# EAGLE design lixie_digit_mini (EAGLE 7.6.0)
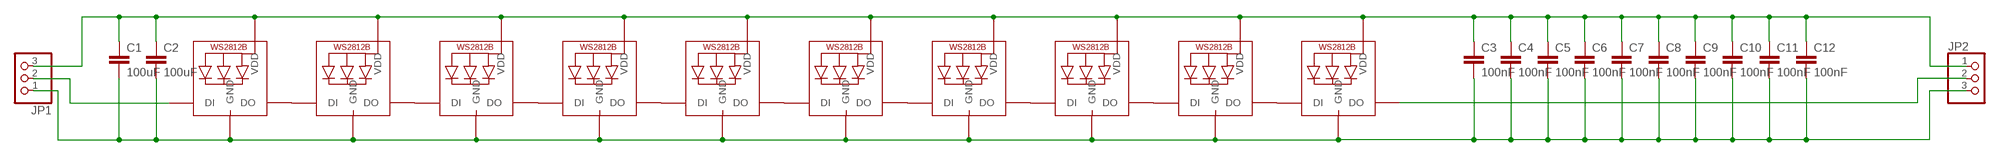
[diagram p0: schematic, sheet 1]

## Parts
C1  100uF  C-EUC1206K  [C1206K]
C2  100uF  C-EUC1206K  [C1206K]
C3  100nF  C-EUC0805K  [C0805K]
C4  100nF  C-EUC0805K  [C0805K]
C5  100nF  C-EUC0805K  [C0805K]
C6  100nF  C-EUC0805K  [C0805K]
C7  100nF  C-EUC0805K  [C0805K]
C8  100nF  C-EUC0805K  [C0805K]
C9  100nF  C-EUC0805K  [C0805K]
C10  100nF  C-EUC0805K  [C0805K]
C11  100nF  C-EUC0805K  [C0805K]
C12  100nF  C-EUC0805K  [C0805K]
JP1  PINHD-1X3  [1X03]
JP2  PINHD-1X3  [1X03]
LED1  WS2812B5050  [WS2812B]
LED2  WS2812B5050  [WS2812B]
LED3  WS2812B5050  [WS2812B]
LED4  WS2812B5050  [WS2812B]
LED5  WS2812B5050  [WS2812B]
LED6  WS2812B5050  [WS2812B]
LED7  WS2812B5050  [WS2812B]
LED8  WS2812B5050  [WS2812B]
LED9  WS2812B5050  [WS2812B]
LED10  WS2812B5050  [WS2812B]

## Nets
GND: C1.2 C2.2 C3.2 C4.2 C5.2 C6.2 C7.2 C8.2 C9.2 C10.2 C11.2 C12.2 JP1.1 JP2.3 LED1.3-GND(GND) LED2.3-GND(GND) LED3.3-GND(GND) LED4.3-GND(GND) LED5.3-GND(GND) LED6.3-GND(GND) LED7.3-GND(GND) LED8.3-GND(GND) LED9.3-GND(GND) LED10.3-GND(GND)
N$1: LED1.2-DOUT(DO) LED2.4-DIN(DI)
N$2: LED2.2-DOUT(DO) LED3.4-DIN(DI)
N$3: LED3.2-DOUT(DO) LED4.4-DIN(DI)
N$4: LED4.2-DOUT(DO) LED5.4-DIN(DI)
N$5: LED5.2-DOUT(DO) LED6.4-DIN(DI)
N$16: LED6.2-DOUT(DO) LED7.4-DIN(DI)
N$17: LED7.2-DOUT(DO) LED8.4-DIN(DI)
N$18: LED8.2-DOUT(DO) LED9.4-DIN(DI)
N$19: LED9.2-DOUT(DO) LED10.4-DIN(DI)
N$23: JP1.2 LED1.4-DIN(DI)
N$24: JP2.2 LED10.2-DOUT(DO)
VCC: C1.1 C2.1 C3.1 C4.1 C5.1 C6.1 C7.1 C8.1 C9.1 C10.1 C11.1 C12.1 JP1.3 JP2.1 LED1.1-VDD(VDD) LED2.1-VDD(VDD) LED3.1-VDD(VDD) LED4.1-VDD(VDD) LED5.1-VDD(VDD) LED6.1-VDD(VDD) LED7.1-VDD(VDD) LED8.1-VDD(VDD) LED9.1-VDD(VDD) LED10.1-VDD(VDD)

## Library data of the parts
C1-C12 = rcl:C-EU: CAPACITOR, European symbol
JP1 JP2 = adafruit:PINHD-1X3: PIN HEADER
LED1-LED10 = adafruit:WS2812B

## Board
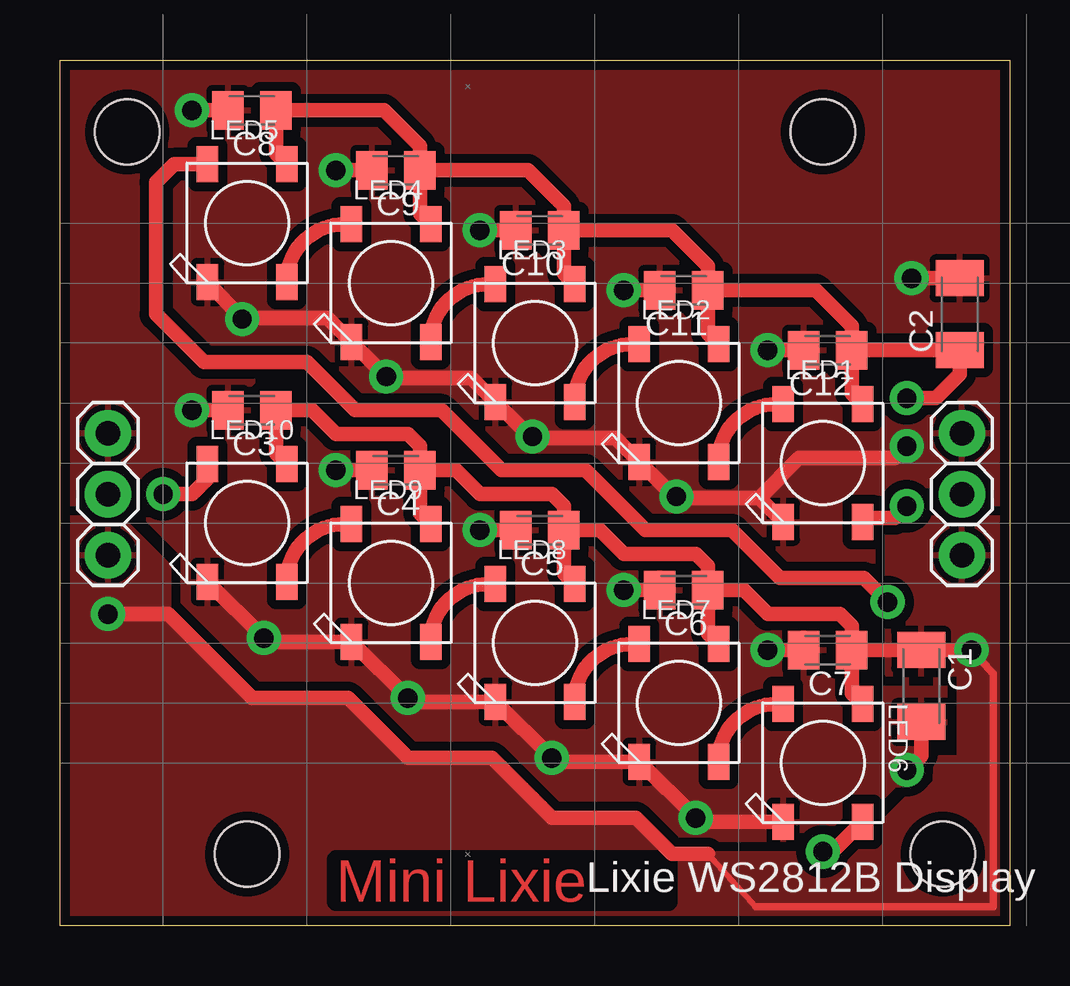
[diagram p1: board, top side]
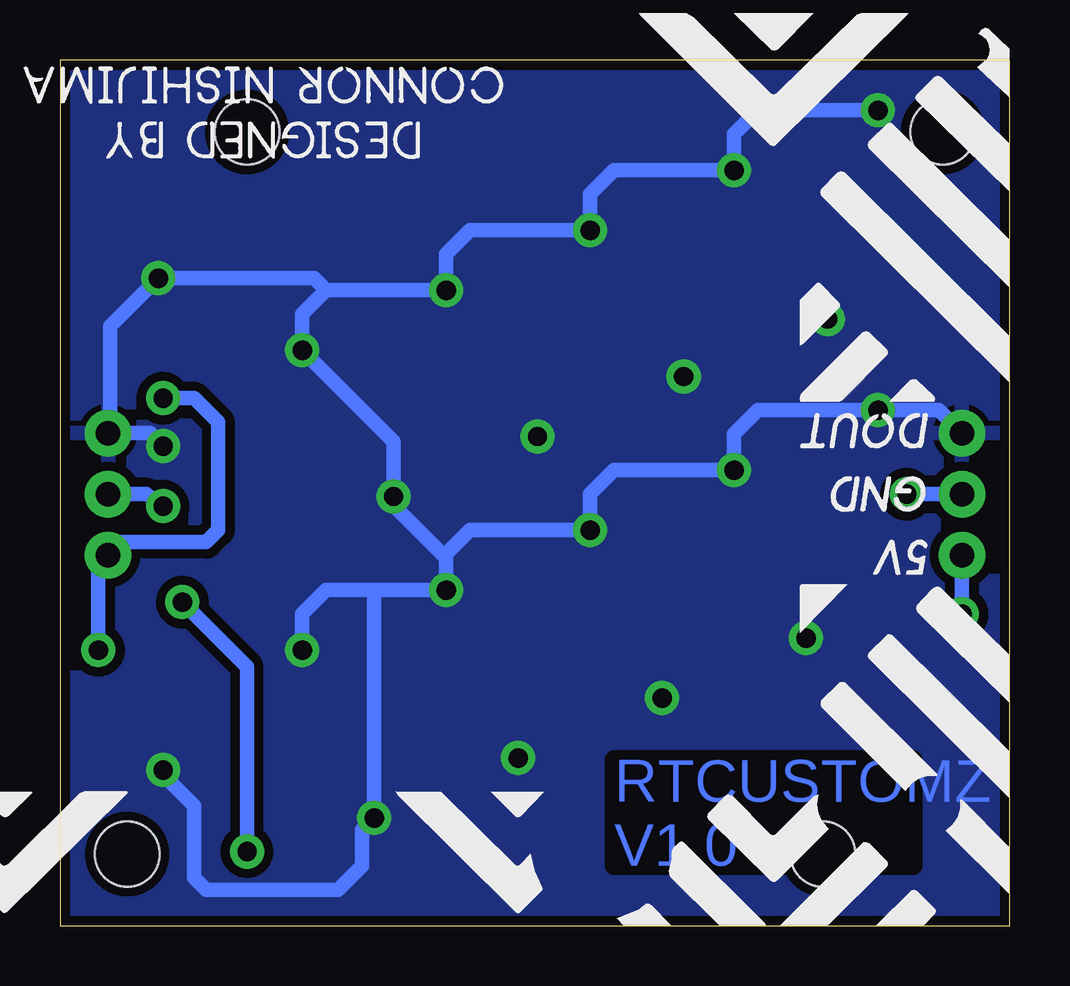
[diagram p2: board, bottom side, seen from below]

Size 39.6 x 36.1 mm. Coordinates in mm from the lower left corner, seen from the top.
Outline: 0,0 0,36.1 39.6,36.1 39.6,0 0,0
Copper layers (1*16): Top 0.035mm / dielectric 1.6mm / Bottom 0.035mm
Design rules "Elecrow_2-layer_PCB_eagle_rule *": minimum track width 6mil, minimum drill 12mil, track to track 15mil, track to pad 15mil, pad to pad 15mil, via to via 15mil, smd to smd 0mil, copper to edge 16mil, drill to drill 10mil, minimum pad ring 6mil, minimum via ring 6mil, stop-mask expansion 0mil, vias tented up to drill 100mil, thermal gap 10mil
Holes 2.7 mm at 2.8,33.1 31.8,33.1 36.8,3 7.8,3

### Footprints (pad centres in the part's own frame; a part is rotated, then mirrored left to right if it is on the bottom)
C1206K = smd 1.5 x 2: 1 -1.5,0; 2 1.5,0
C0805K = smd 1.3 x 1.6: 1 -1,0; 2 1,0
1X03 = drill 1.016 pad 1.93: 1 -2.54,0; 2 0,0; 3 2.54,0
WS2812B = smd 1.5 x 0.9: 1-VDD 2.45,-1.65; 2-DOUT 2.45,1.65; 3-GND -2.45,1.65; 4-DIN -2.45,-1.65

### Placement (x,y rotation side)
C1  35.9,10 270 top
C2  37.5,25.5 90 top
C3  8,21.5 180 top
C4  14,19 180 top
C5  20,16.5 180 top
C6  26,14 180 top
C7  32,11.5 180 top
C8  8,34 180 top
C9  14,31.5 180 top
C10  20,29 180 top
C11  26,26.5 180 top
C12  32,24 180 top
JP1  37.6,18 270 top
JP2  2,18 90 top
LED1  31.8,19.3 90 top
LED2  25.8,21.8 90 top
LED3  19.8,24.3 90 top
LED4  13.8,26.8 90 top
LED5  7.8,29.3 90 top
LED6  31.8,6.8 90 top
LED7  25.8,9.3 90 top
LED8  19.8,11.8 90 top
LED9  13.8,14.3 90 top
LED10  7.8,16.8 90 top

### Tracks (layer width: path | path; a pad name or v marks a point on that pad's centre or on a via)
GND  (via drill 0.8 pad 1.42)
  Top 0.61: LED10.3-GND v8.5,12 8.65,11.85 LED9.3-GND v14.5,9.5 14.65,9.35 LED8.3-GND v20.5,7 20.65,6.85 LED7.3-GND v26.5,4.5 26.65,4.35 LED6.3-GND | C12.2 v29.5,24 | C11.2 v23.5,26.5 | v17.5,29 C10.2 | v11.5,31.5 C9.2 | v5.5,34 C8.2 | C2.2 v35.5,27 | C7.2 v29.5,11.5 | v23.5,14 C6.2 | v17.5,16.5 C5.2 | v11.5,19 C4.2 | v5.5,21.5 C3.2 | 29.15,17.85 25.65,17.85 LED2.3-GND 23.15,20.35 19.65,20.35 LED3.3-GND 17.15,22.85 13.65,22.85 LED4.3-GND 11.15,25.35 7.65,25.35 v7.6,25.3 LED5.3-GND | 29.15,17.85 LED1.3-GND | 29.15,17.85 30.8,19.5 34.8,19.5 v35.3,20 | 35.5,8.2 C1.2 35.9,7.1 v35.3,6.5
  Bottom 0.61: 28.5,26.5 29.5,25.5 v29.5,24 25.7,20.2 v25.7,17.9 | 28.5,26.5 v23.5,26.5 23.5,28 22.5,29 v17.5,29 17.5,30.5 16.5,31.5 v11.5,31.5 11.5,33 10.5,34 v5.5,34 | 28.5,26.5 29,27 v35.5,27 37.5,25 37.5,20.5 | v29.5,11.5 29.5,13 28.5,14 26.5,14 | 26.5,14 v23.5,14 | v23.5,14 23.5,15.5 22.5,16.5 v17.5,16.5 17.5,18 16.5,19 v11.5,19 11.5,20.5 10.5,21.5 v5.5,21.5 2.96,21.5 JP2.3 | 26.5,14 v26.5,4.5 27,4 27,2.5 28,1.5 33.5,1.5 34,2 34,5 35.5,6.5 v35.3,6.5 | v23.5,14 23.5,15.35 26,17.85 | JP1.1 35.84,20.54 v35.3,20
  other vias: 13.6,22.9 19.7,20.4
  pour Top (rank 2): 40.5,-0.5 -1,-0.5 -1,36.5 40.5,36.5
  pour Bottom: -1.5,36.5 40.5,36.5 40.5,-0.5 -1.5,-0.5
N$1
  Top 0.61: LED1.2-DOUT 29.85,21.75 arc90 LED2.4-DIN
N$2
  Top 0.61: LED2.2-DOUT 23.85,24.25 arc90 LED3.4-DIN
N$3
  Top 0.61: LED3.2-DOUT 17.85,26.75 arc90 LED4.4-DIN
N$4
  Top 0.61: LED4.2-DOUT 11.85,29.25 arc90 LED5.4-DIN
N$5  (via drill 0.8 pad 1.42)
  Top 0.61: LED5.2-DOUT 4.75,31.75 4,31 4,25.5 6,23.5 10.3,23.5 12.3,21.5 15.9,21.5 18.4,19 21.9,19 24.4,16.5 28,16.5 30,14.5 33.5,14.5 v34.5,13.5 | v31.8,3.1 32.2,3.1 LED6.4-DIN
  Bottom 0.61: v31.8,3.1 31.8,10.8 v34.5,13.5
N$16
  Top 0.61: LED6.2-DOUT 29.85,9.25 arc90 LED7.4-DIN
N$17
  Top 0.61: LED7.2-DOUT 23.85,11.75 arc90 LED8.4-DIN
N$18
  Top 0.61: LED8.2-DOUT 17.85,14.25 arc90 LED9.4-DIN
N$19
  Top 0.61: LED9.2-DOUT 11.85,16.75 arc90 LED10.4-DIN
N$23  (via drill 0.8 pad 1.42)
  Top 0.61: 33.5,16.9 LED1.4-DIN 33.6,17 34.8,17 v35.3,17.5
  Bottom 0.61: v35.3,17.5 36,18 JP1.2
N$24  (via drill 0.8 pad 1.42)
  Top 0.61: v4.3,18 5.5,18 6.15,18.65 LED10.2-DOUT
  Bottom 0.61: JP2.2 v4.3,18
VCC  (via drill 0.8 pad 1.42)
  Top 0.254: 27,3 29,0.8
  Top 0.305: 29,0.8 38.9,0.8 38.9,10.5 v38,11.5
  Top 0.61: LED10.1-VDD 9,19.7 C3.1 10.5,21.5 11.5,20.5 14.5,20.5 15,20 C4.1 | LED9.1-VDD 15,17.2 C4.1 | LED8.1-VDD 21,14.7 C5.1 | LED7.1-VDD 27,12.2 C6.1 | LED6.1-VDD 33,9.7 C7.1 | LED1.1-VDD 33,22.2 C12.1 | LED2.1-VDD 27,24.7 C11.1 | LED3.1-VDD 21,27.2 C10.1 | LED4.1-VDD 15,29.7 C9.1 | LED5.1-VDD 9,32.2 C8.1 13.5,34 15,32.5 C9.1 | C5.1 21,17.5 20.5,18 17.5,18 16.5,19 C4.1 | C9.1 19.5,31.5 21,30 C10.1 | C10.1 25.5,29 27,27.5 C11.1 | C11.1 31.5,26.5 33,25 C12.1 | C7.1 C1.1 v38,11.5 | C12.1 C2.1 37.5,23 36.5,22 v35.3,22 | C6.1 27,15 26.5,15.5 23.5,15.5 22.5,16.5 C5.1 | C7.1 33,12.5 32.5,13 29.5,13 28.5,14 C6.1 | 27,3 25.5,3 24,4.5 20.5,4.5 18,7 14.5,7 12,9.5 8,9.5 4.5,13 v2,13
  Bottom 0.61: v35.3,22 34,22 33,21 33,16.5 33.5,16 37.56,16 JP1.3 38,15.46 v38,11.5 | v2,13 JP2.1
  pour Top: -0.5,17 2.5,17 4,15.5 4.5,15 4.5,13 8,9.5 12,9.5 14.5,7 18,7 20.5,4.5 24,4.5 25.5,3 33,3 35.5,5.5 36,5.5 36.5,6 36.5,7 37.5,7 37.5,9 37.5,10.5 34.5,10.5 34.5,17 40,17 40,-0.5 -0.5,-0.5

### Text on the board
Top: Mini Lixie
Bottom: RTCUSTOMZ / V1.0
tNames: REV.2 | Lixie WS2812B Display
tDocu: Lixie Display PCB | Revision 2 | Layout by Connor Nishijima | Last Updated: / December 16th, 2016 | Released under the GPLv3 License | [OSHW] US000054